# EAGLE design untitled (EAGLE 8.3.0)
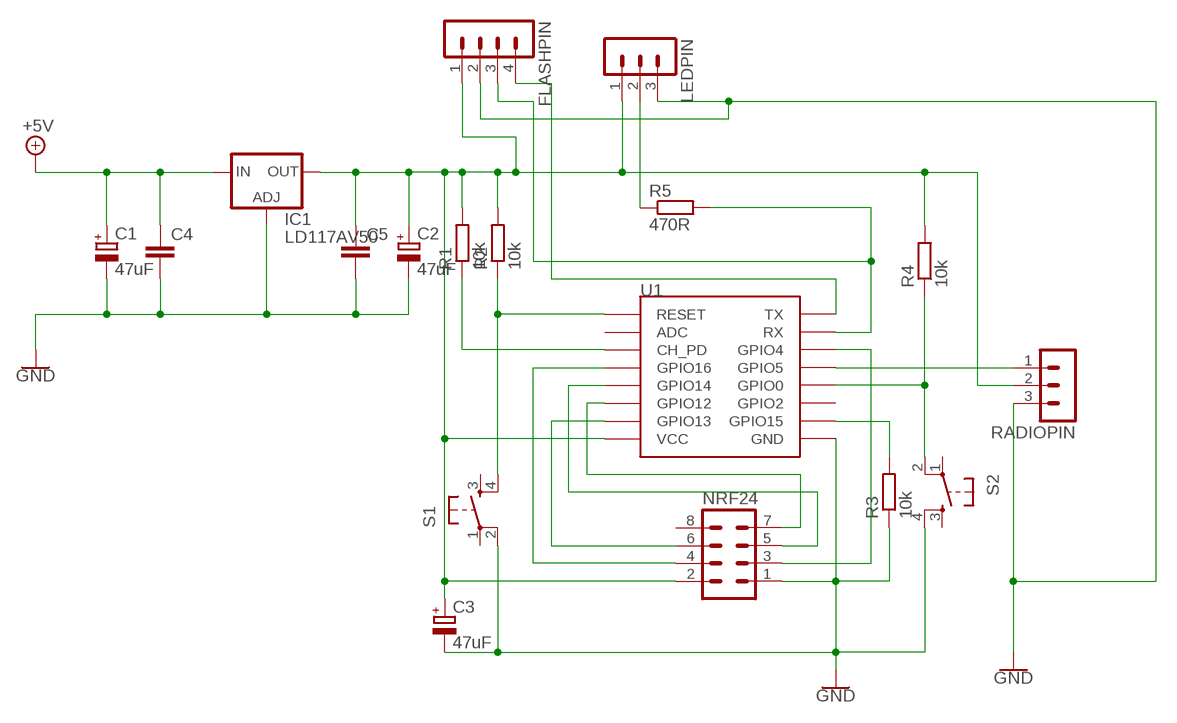
[diagram p0: schematic, sheet 1]

## Parts
C1  47uF  CPOL-EUE2-5  [E2-5]
C2  47uF  CPOL-EUE2-5  [E2-5]
C3  47uF  CPOL-EUE2-5  [E2-5]
C4  C-EU025-025X050  [C025-025X050]
C5  C-EU025-025X050  [C025-025X050]
FLASHPIN  MA04-1  [MA04-1]
IC1  LD117AV50  [TO220L1]
LEDPIN  MA03-1  [MA03-1]
NRF24  MA04-2  [MA04-2]
R1  10k  R-EU_0207/10  [0207/10]
R2  10k  R-EU_0207/10  [0207/10]
R3  10k  R-EU_0207/10  [0207/10]
R4  10k  R-EU_0207/10  [0207/10]
R5  470R  R-EU_0207/10  [0207/10]
RADIOPIN  MA03-1  [MA03-1]
S1  TAC_SWITCHPTH  [TACTILE-PTH]
S2  TAC_SWITCHPTH  [TACTILE-PTH]
U1  ESP12  [ESP12]

## Nets
GND: C1.- C2.- C3.- C4.2 C5.2 FLASHPIN.2 IC1.1(ADJ) LEDPIN.3 NRF24.1 R3.1 RADIOPIN.3 S1.2 S2.4 U1.GND
N$1: NRF24.6 U1.GPIO13
N$2: R2.1 S1.4 U1.RESET
N$3: R1.1 U1.CH_PD
N$5: C2.+ C3.+ C5.1 FLASHPIN.1 IC1.2(OUT) LEDPIN.1 NRF24.2 R1.2 R2.2 R4.2 RADIOPIN.2 U1.VCC
N$6: R3.2 U1.GPIO15
N$7: NRF24.7 U1.GPIO12
N$8: NRF24.5 U1.GPIO14
N$9: NRF24.3 U1.GPIO4
N$10: NRF24.4 U1.GPIO16
N$12: RADIOPIN.1 U1.GPIO5
N$14: C1.+ C4.1 IC1.3(IN) ; supply symbol labelled +5V
N$36: FLASHPIN.3 R5.2 U1.RX
N$38: R4.1 S2.2 U1.GPIO0
N$39: LEDPIN.2 R5.1
N$42: FLASHPIN.4 U1.TX
Unconnected: NRF24.8 S1.1 S1.3 S2.1 S2.3 U1.ADC U1.GPIO2

## Library data of the parts
C1-C3 = rcl:CPOL-EU: POLARIZED CAPACITOR, European symbol
C4 C5 = rcl:C-EU: CAPACITOR, European symbol
FLASHPIN = con-lstb:MA04-1: PIN HEADER; OC_FARNELL: unknown; OC_NEWARK: unknown
IC1 = v-reg:LD117A?*: Low drop fixed and adjustable positive voltage regulators 1 A Source: http://www.st.com/stonline/products/literature/ds/7194/ld1117axx.pdf
LEDPIN RADIOPIN = con-lstb:MA03-1: PIN HEADER; OC_FARNELL: unknown; OC_NEWARK: unknown
NRF24 = con-lstb:MA04-2: PIN HEADER; OC_FARNELL: unknown; OC_NEWARK: unknown
R1-R5 = rcl:R-EU_: RESISTOR, European symbol
S1 S2 = SparkFun-Retired:TAC_SWITCH: Momentary Switch Button commonly used for reset or general input. Spark Fun Electronics SKU : COM-00097 SMT- SWCH-08247
U1 = esp8266modules:ESP12: ESP8266 Wifi module 12

## Board
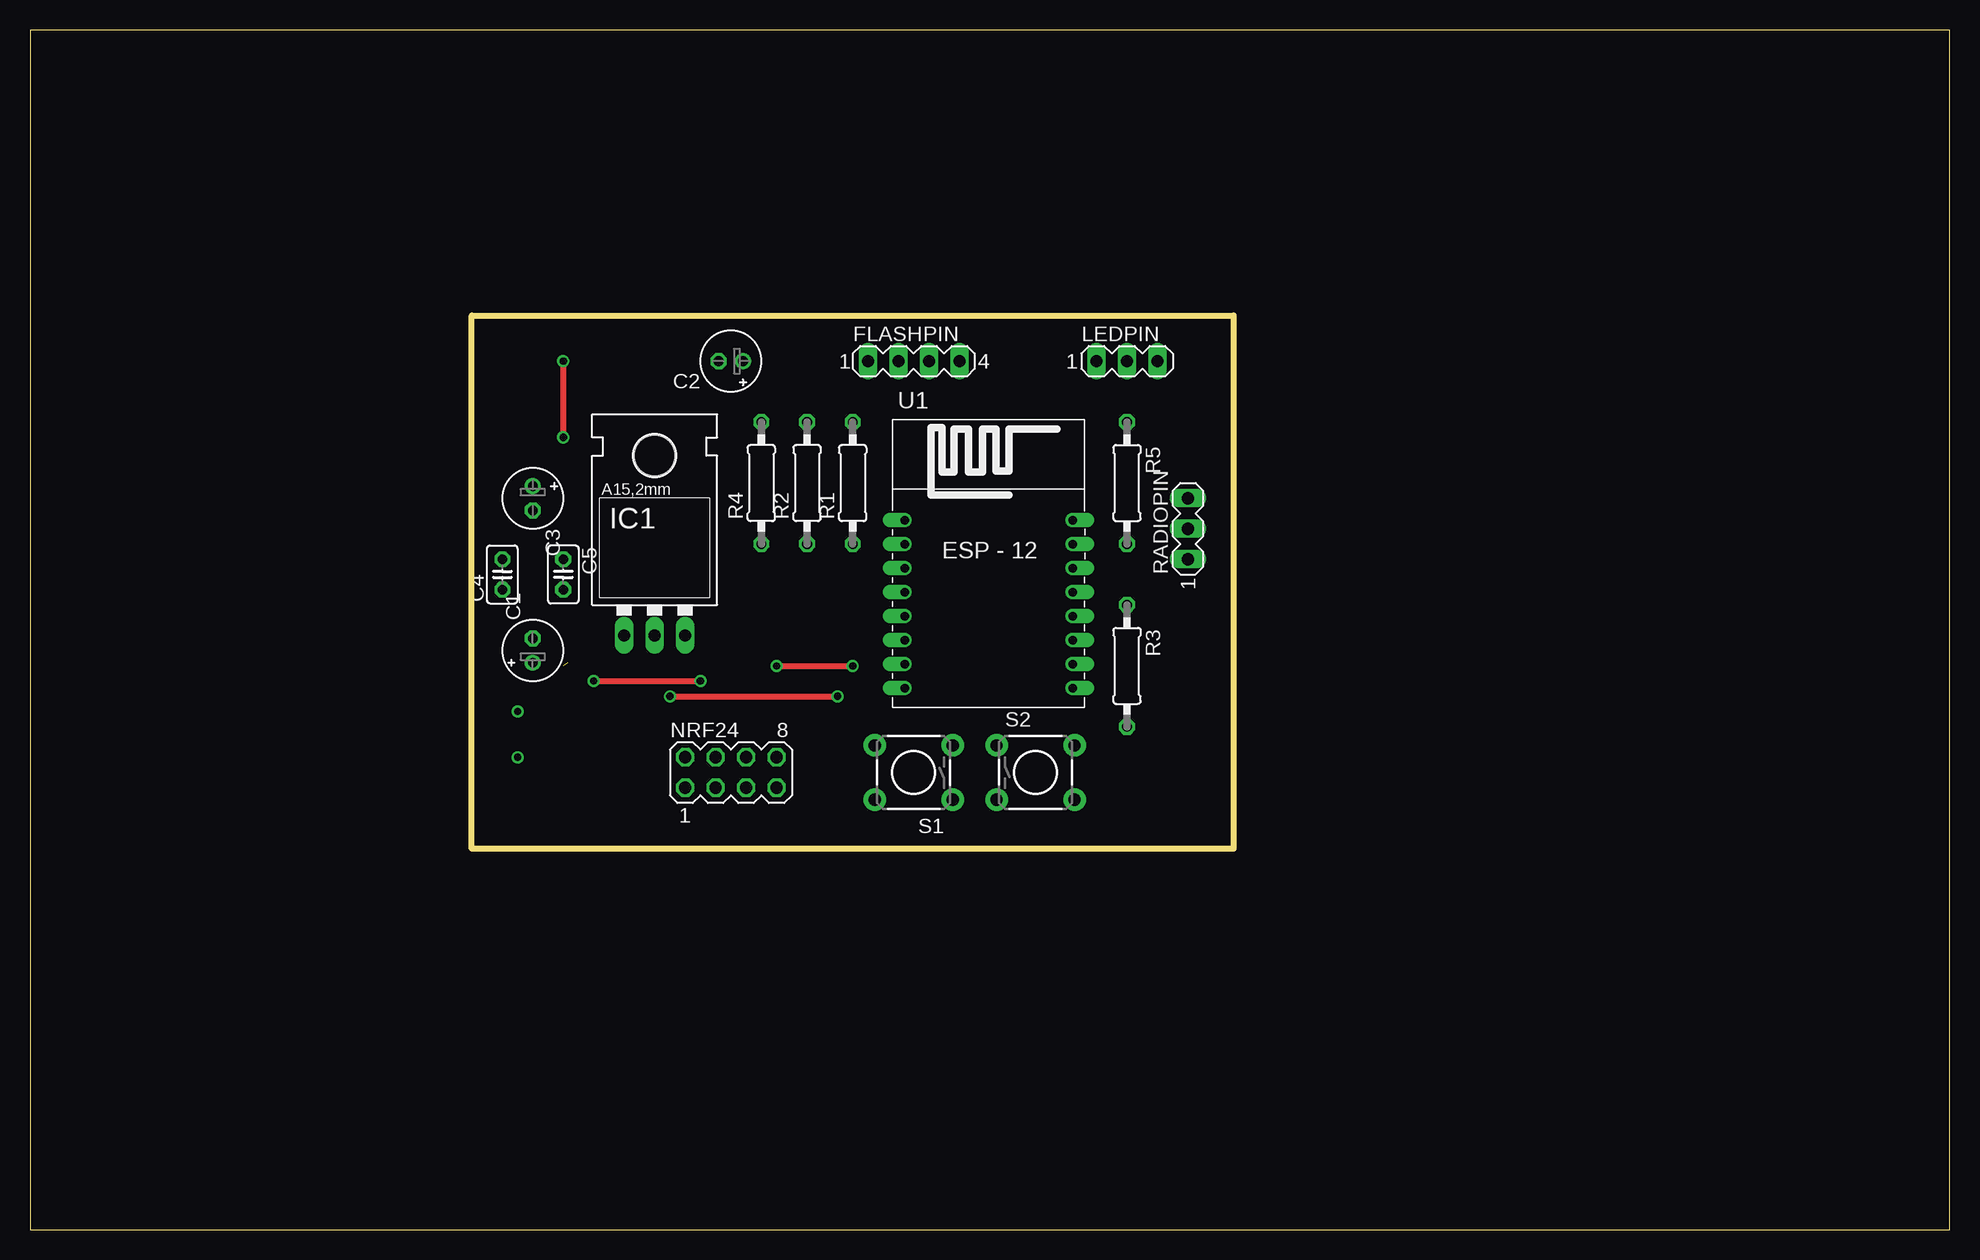
[diagram p1: board, top side]
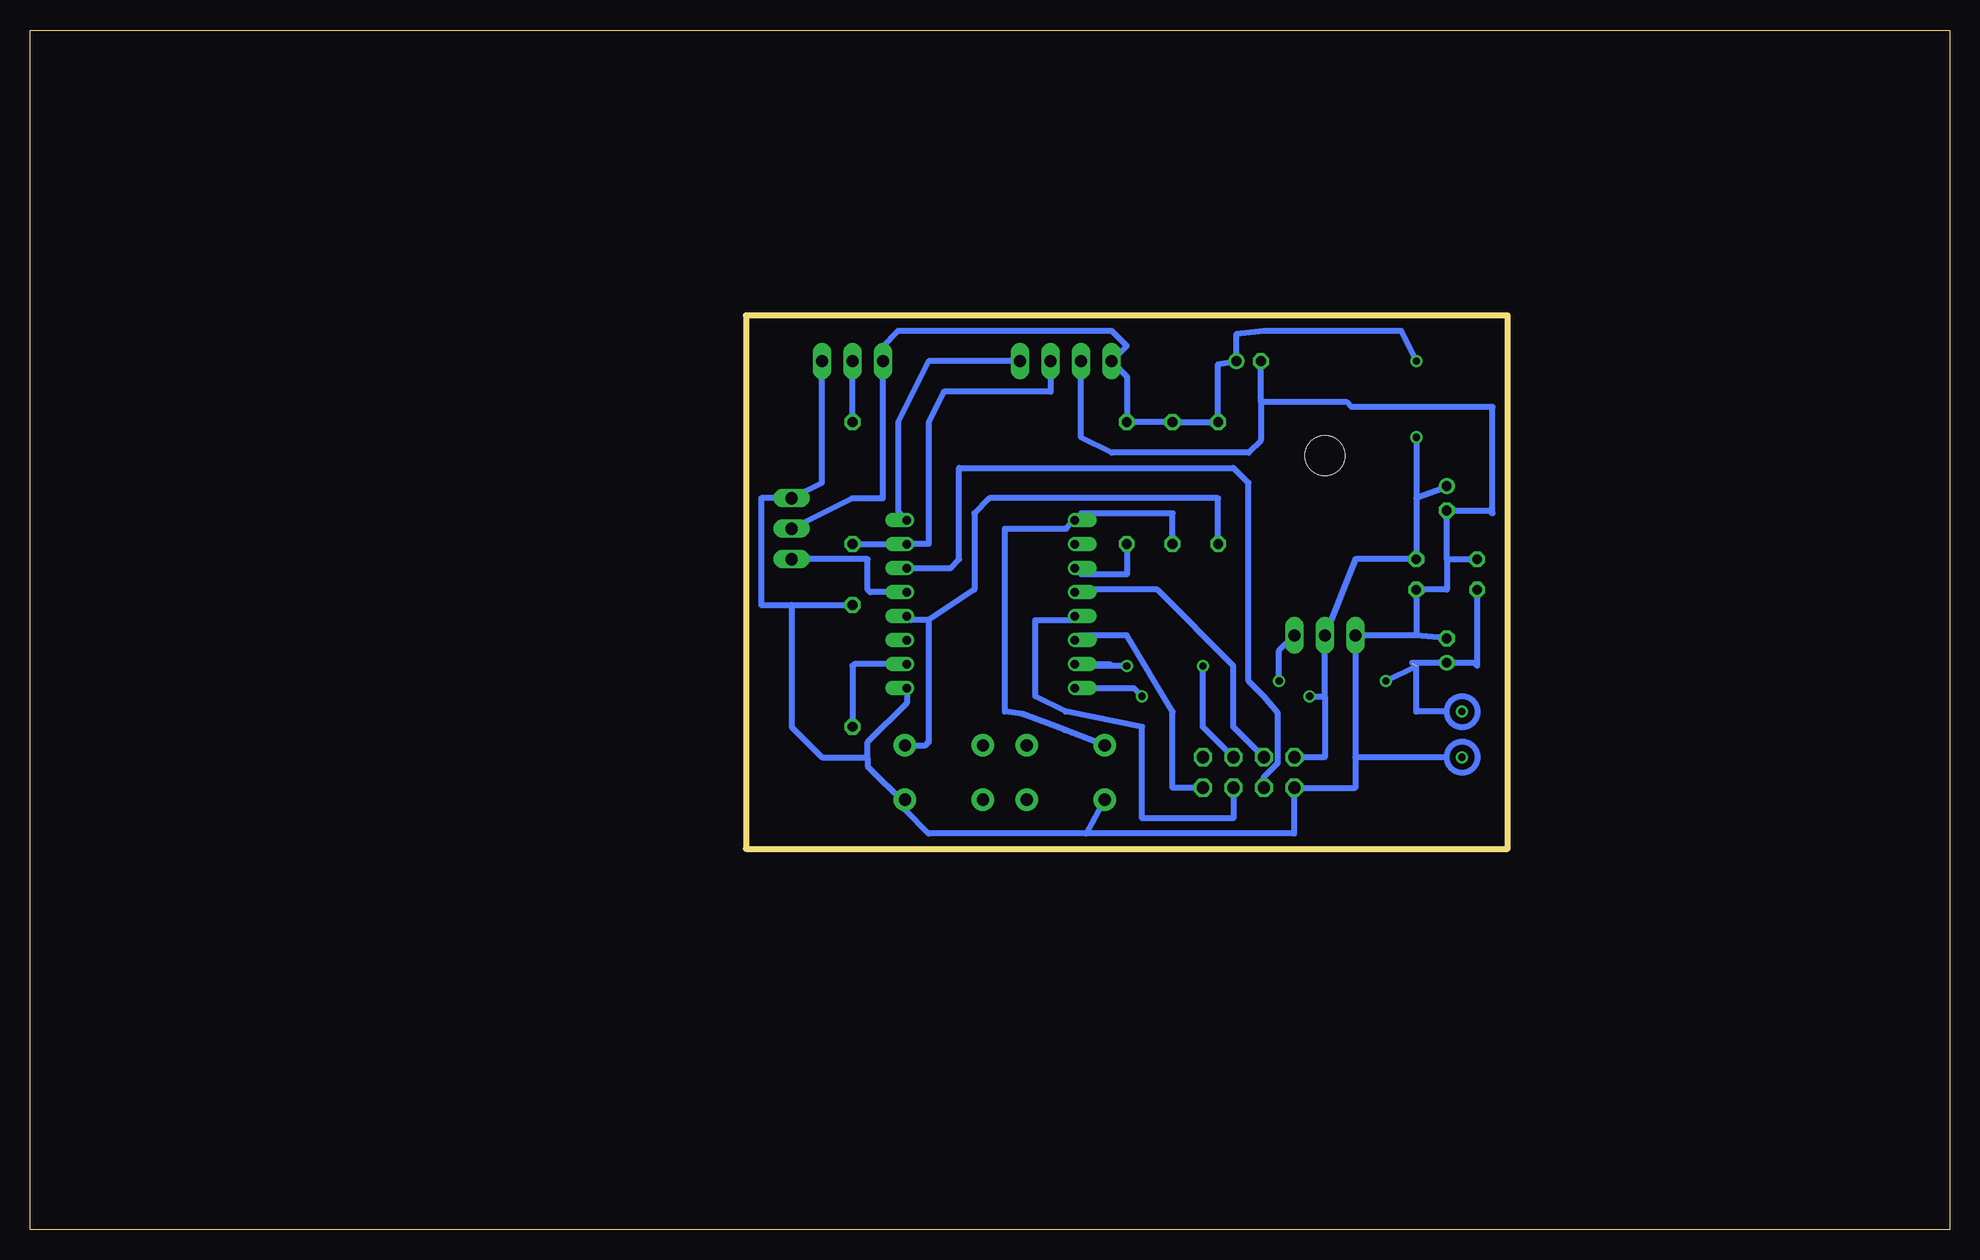
[diagram p2: board, bottom side, seen from below]

Size 160 x 100 mm. Coordinates in mm from the lower left corner, seen from the top.
Outline: 0,0 160,0 160,100 0,100 0,0
Outline: 36.83,76.2 100.33,76.2 100.33,31.75 36.83,31.75 36.83,76.2
Copper layers (1*16): Top 0.035mm / dielectric 1.5mm / Bottom 0.035mm
Design rules "default": minimum track width 6mil, minimum drill 0.35mm, track to track 6mil, track to pad 6mil, pad to pad 6mil, via to via 6mil, smd to smd 6mil, copper to edge 40mil, drill to drill 6mil, minimum pad ring 10mil, minimum via ring 8mil, stop-mask expansion 4mil, vias tented up to drill 0mil, thermal gap 10mil

### Footprints (pad centres in the part's own frame; a part is rotated, then mirrored left to right if it is on the bottom)
E2-5 = drill 0.813 pad 1.27: + -1.016,0 | drill 0.813 pad 1.27 octagon: - 1.016,0
C025-025X050 = drill 0.813 octagon: 1 -1.27,0; 2 1.27,0
MA04-1 = drill 1.016 long: 1 -3.81,0; 2 -1.27,0; 3 1.27,0; 4 3.81,0
TO220L1 = drill 1.016 long: 1 -2.54,-3.81; 2 0,-3.81; 3 2.54,-3.81 | hole 3.302: 0,11.176
MA03-1 = drill 1.016 long: 1 -2.54,0; 2 0,0; 3 2.54,0
MA04-2 = drill 1.016 octagon: 1 -3.81,-1.27; 2 -3.81,1.27; 3 -1.27,-1.27; 4 -1.27,1.27; 5 1.27,-1.27; 6 1.27,1.27; 7 3.81,-1.27; 8 3.81,1.27
0207/10 = drill 0.813 octagon: 1 -5.08,0; 2 5.08,0
TACTILE-PTH = drill 1.016 pad 1.88: 1 -3.251,2.261; 2 3.251,2.261; 3 -3.251,-2.261; 4 3.251,-2.261
ESP12 = drill 0.7 offset: ADC -7.1,3.8; CH_PD -7.1,1.8; GND 6.9,-8.2; GPIO0 6.9,-2.2; GPIO2 6.9,-4.2; GPIO4 6.9,1.8; GPIO5 6.9,-0.2; GPIO12 -7.1,-4.2; GPIO13 -7.1,-6.2; GPIO14 -7.1,-2.2; GPIO15 6.9,-6.2; GPIO16 -7.1,-0.2; RESET -7.1,5.8; RX 6.9,3.8; TX 6.9,5.8; VCC -7.1,-8.2

### Placement (x,y rotation side)
C1  41.91,48.26 90 top
C2  58.42,72.39 180 top
C3  41.91,60.96 270 top
C4  39.37,54.61 90 top
C5  44.45,54.61 270 top
FLASHPIN  73.66,72.39 0 top
IC1  52.07,53.34 0 top
LEDPIN  91.44,72.39 0 top
NRF24  58.42,38.1 0 top
R1  68.58,62.23 90 top
R2  64.77,62.23 90 top
R3  91.44,46.99 270 top
R4  60.96,62.23 90 top
R5  91.44,62.23 270 top
RADIOPIN  96.52,58.42 90 top
S1  73.66,38.1 180 top
S2  83.82,38.1 0 top
U1  80.01,53.34 0 top

### Tracks (layer width: path | path; a pad name or v marks a point on that pad's centre or on a via)
GND
  Bottom 0.508: LEDPIN.3 93.98,62.23 RADIOPIN.3 99.06,60.96 99.06,52.07 96.52,52.07 | 87.07,35.51 S2.4 | 87.07,35.51 87.07,35 85.09,33.02 71.96,33.02 | 71.96,33.02 S1.2 | 71.96,33.02 54.61,33.02 NRF24.1 49.53,36.83 49.53,39.37 | 49.53,39.37 IC1.1 44.45,49.53 | C1.- 41.66,49.28 44.45,49.53 | 44.45,53.32 C5.2 | 44.45,53.32 44.45,49.53 | 41.91,39.37 49.53,39.37 | 41.91,55.88 C4.2 | 41.91,55.88 41.91,53.34 44.43,53.34 44.45,53.32 | 57.4,69.06 C2.- | 57.4,69.06 57.4,65.79 58.42,64.77 69.85,64.77 72.39,66.04 FLASHPIN.2 | 41.91,55.88 C3.- 38.35,59.94 38.1,59.69 38.1,68.58 49.85,68.58 50.23,68.96 57.31,68.96 57.4,69.06 | U1.GND 86.91,43.9 90.17,40.64 90.17,39.27 | 90.17,39.27 90.17,38.61 87.07,35.51 | 96.52,52.07 R3.1 | 96.52,52.07 96.52,41.91 93.98,39.37 90.27,39.37 90.17,39.27
N$1  (via drill 0.6)
  Top 0.508: v62.23,46.99 v68.58,46.99
  Bottom 0.508: 69.19,46.99 v68.58,46.99 69.85,46.99 | NRF24.6 62.23,41.91 v62.23,46.99 | U1.GPIO13 70,47.14 69.85,46.99 | 69.85,46.99 71.12,46.99
N$2
  Bottom 0.508: R2.1 64.77,59.69 72.36,59.69 U1.RESET 73.63,58.42 78.74,58.42 78.74,43.18 77.27,42.98 73.81,41.71 73.74,41.63 S1.4
N$3
  Bottom 0.508: R1.1 68.58,54.61 72.38,54.61 U1.CH_PD
N$4  (via drill 0.6)
  other vias: 40.64,39.37
N$5  (via drill 0.6)
  Top 0.508: v44.45,72.39 v44.45,66.04 | v53.34,44.45 v67.31,44.45
  Bottom 0.508: v44.45,66.04 44.45,60.96 | RADIOPIN.2 91.44,60.96 88.9,60.96 LEDPIN.1 88.9,73.66 87.63,74.93 69.85,74.93 68.58,73.66 FLASHPIN.1 68.58,71.12 R1.2 R2.2 R4.2 60.96,72.14 C2.+ 59.44,74.68 57.15,74.93 45.72,74.93 v44.45,72.39 | U1.VCC 68,45.14 v67.31,44.45 | NRF24.2 52.07,39.37 52.07,44.38 | 52.07,44.38 IC1.2 49.53,55.88 C5.1 44.45,60.96 | C3.+ 41.66,61.98 44.45,60.96 | v53.34,44.45 52.14,44.45 52.07,44.38
N$6
  Bottom 0.508: U1.GPIO15 91.29,47.14 91.44,46.99 R3.2
N$7
  Bottom 0.508: NRF24.7 64.77,36.83 64.77,43.18 68.58,49.53 72.52,49.53 U1.GPIO12
N$8
  Bottom 0.508: NRF24.5 59.69,34.29 67.31,34.29 67.31,41.91 73.66,43.18 76.2,44.45 76.2,50.8 73.25,50.8 U1.GPIO14
N$9
  Bottom 0.508: U1.GPIO4 83.29,55.14 82.55,55.88 82.55,63.5 59.69,63.5 58.42,62.23 58.42,45.72 57.15,44.45 55.98,43.08 55.98,38.89 57.15,37.72 NRF24.3
N$10
  Bottom 0.508: NRF24.4 59.69,41.91 59.69,46.99 66.04,53.34 72.71,53.34 U1.GPIO16
N$12
  Bottom 0.508: U1.GPIO5 89.97,53.14 90.17,53.34 90.17,55.88 RADIOPIN.1
N$13  (via drill 0.6)
  other vias: 40.64,43.18
N$14  (via drill 0.6)  (1 unrouted)
  Top 0.508: v46.99,45.72 v55.88,45.72
  Bottom 0.508: 41.91,43.18 44.45,43.18 44.45,46.99 v46.99,45.72 | C4.1 39.37,46.99 39.62,47.24 C1.+ 44.81,47.24 | v55.88,45.72 55.88,48.26 IC1.3
N$36
  Bottom 0.508: FLASHPIN.3 74.93,69.85 83.82,69.85 85.09,67.31 85.09,57.15 U1.RX R5.2
N$38
  Bottom 0.508: S2.2 85.37,40.36 85.09,40.64 85.09,50.8 | 85.09,50.8 86.57,50.8 U1.GPIO0 | R4.1 60.96,60.96 80.01,60.96 81.28,59.69 81.28,53.34 85.09,50.8
N$39
  Bottom 0.508: R5.1 LEDPIN.2
N$42
  Bottom 0.508: FLASHPIN.4 85.09,72.39 87.63,67.31 87.63,59.86 U1.TX
(copper drawn outside any net)
  shapes: Bottom circle x2